# Altium schematic sheet Device.SchDoc
size A4; SheetNumber: 1; SheetTotal: 11
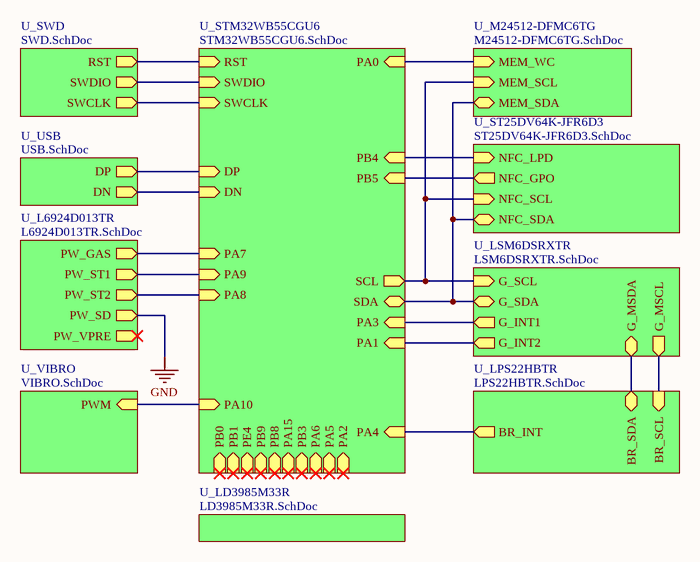
[diagram p0: Device.SchDoc]

## Sub-sheets
U_L6924D013TR = L6924D013TR.SchDoc: PW_GAS (out), PW_ST1 (out), PW_ST2 (out), PW_SD (out), PW_VPRE (out)
U_LD3985M33R = LD3985M33R.SchDoc: no entries
U_LPS22HBTR = LPS22HBTR.SchDoc: BR_SCL (in), BR_SDA (bidir), BR_INT (out)
U_LSM6DSRXTR = LSM6DSRXTR.SchDoc: G_MSCL (out), G_MSDA (bidir), G_SCL (in), G_SDA (bidir), G_INT1 (out), G_INT2 (out)
U_M24512-DFMC6TG = M24512-DFMC6TG.SchDoc: MEM_SDA (bidir), MEM_SCL (in), MEM_WC (in)
U_ST25DV64K-JFR6D3 = ST25DV64K-JFR6D3.SchDoc: NFC_SCL (in), NFC_SDA (bidir), NFC_GPO (out), NFC_LPD (in)
U_STM32WB55CGU6 = STM32WB55CGU6.SchDoc: SCL (out), SDA (bidir), DP (in), DN (in), RST (in), SWDIO (in), SWCLK (in), PA0 (in), PA1 (in), PA15 (in), PA7 (in), PB4 (in), PB3 (in), PA4 (in), PA5 (in), PA10 (in), PA6 (in), PA2 (in), PA3 (in), PB8 (in), PB9 (in), PB5 (in), PE4 (in), PB1 (in), PB0 (in), PA8 (in), PA9 (in)
U_SWD = SWD.SchDoc: RST (out), SWDIO (out), SWCLK (out)
U_USB = USB.SchDoc: DP (out), DN (out)
U_VIBRO = VIBRO.SchDoc: PWM (in)

## Nets
GND: sheet U_L6924D013TR/PW_SD
(unnamed): sheet U_STM32WB55CGU6/SCL, sheet U_M24512-DFMC6TG/MEM_SCL, sheet U_ST25DV64K-JFR6D3/NFC_SCL, sheet U_LSM6DSRXTR/G_SCL
(unnamed): sheet U_STM32WB55CGU6/SDA, sheet U_M24512-DFMC6TG/MEM_SDA, sheet U_ST25DV64K-JFR6D3/NFC_SDA, sheet U_LSM6DSRXTR/G_SDA
(unnamed): sheet U_STM32WB55CGU6/DP, sheet U_USB/DP
(unnamed): sheet U_STM32WB55CGU6/DN, sheet U_USB/DN
(unnamed): sheet U_STM32WB55CGU6/RST, sheet U_SWD/RST
(unnamed): sheet U_STM32WB55CGU6/SWDIO, sheet U_SWD/SWDIO
(unnamed): sheet U_STM32WB55CGU6/SWCLK, sheet U_SWD/SWCLK
(unnamed): sheet U_STM32WB55CGU6/PA0, sheet U_M24512-DFMC6TG/MEM_WC
(unnamed): sheet U_STM32WB55CGU6/PA1, sheet U_LSM6DSRXTR/G_INT2
(unnamed): sheet U_STM32WB55CGU6/PA7, sheet U_L6924D013TR/PW_GAS
(unnamed): sheet U_STM32WB55CGU6/PB4, sheet U_ST25DV64K-JFR6D3/NFC_LPD
(unnamed): sheet U_STM32WB55CGU6/PA4, sheet U_LPS22HBTR/BR_INT
(unnamed): sheet U_STM32WB55CGU6/PA10, sheet U_VIBRO/PWM
(unnamed): sheet U_STM32WB55CGU6/PA3, sheet U_LSM6DSRXTR/G_INT1
(unnamed): sheet U_STM32WB55CGU6/PB5, sheet U_ST25DV64K-JFR6D3/NFC_GPO
(unnamed): sheet U_STM32WB55CGU6/PA8, sheet U_L6924D013TR/PW_ST2
(unnamed): sheet U_STM32WB55CGU6/PA9, sheet U_L6924D013TR/PW_ST1
(unnamed): sheet U_LSM6DSRXTR/G_MSCL, sheet U_LPS22HBTR/BR_SCL
(unnamed): sheet U_LSM6DSRXTR/G_MSDA, sheet U_LPS22HBTR/BR_SDA